# Altium project PCB_Project.PrjPcb
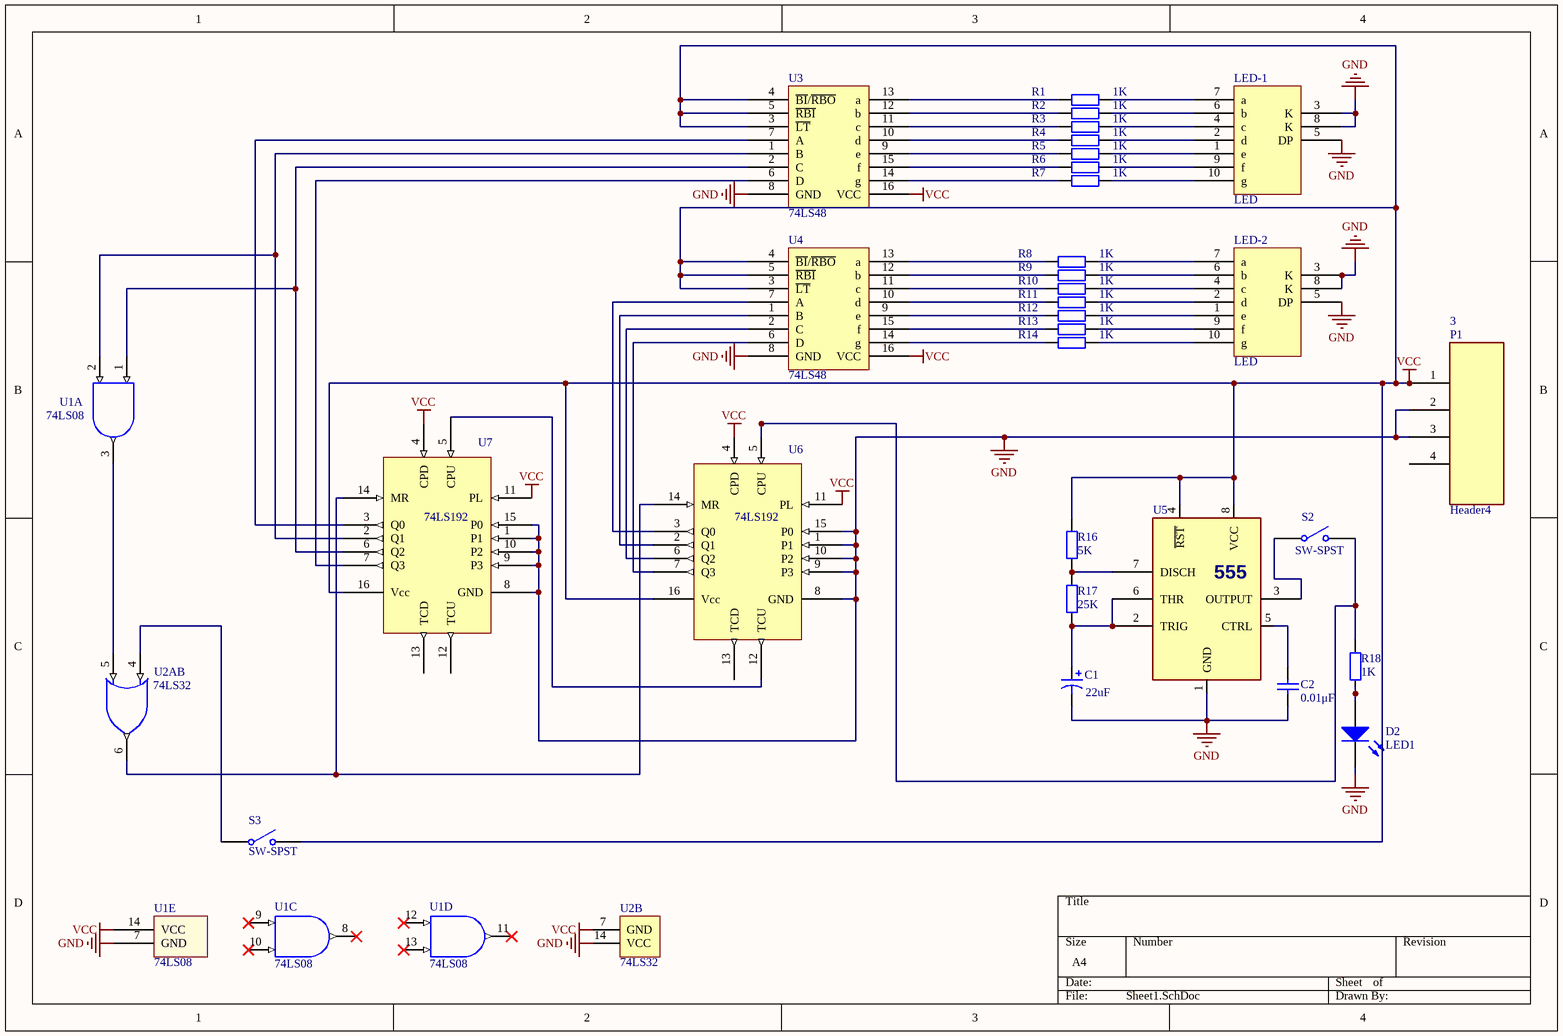
[diagram p0: Sheet1.SchDoc]
1 sheet, 33 parts. Net scope: global (net labels, ports and power ports of the same name join across sheets).
Board file: PCB1.PcbDoc

## Sheet Sheet1.SchDoc
size A4; SheetNumber: 1; SheetTotal: 1

### Parts
3  (no value)  [SIP4]
C1  value 22uF  [RB.2/.4]  (hidden comment: Cap Pol1)
C2  value 0.01μF  [RAD0.2]
D2  LED1  [RAD0.1]
LED-1  LED  [DPY_10-SEG_DP(LED)]
LED-2  LED  [DPY_10-SEG_DP(LED)]
R1  value 1K  [AXIAL-0.4]
R2  value 1K  [AXIAL-0.4]
R3  value 1K  [AXIAL-0.4]
R4  value 1K  [AXIAL-0.4]
R5  value 1K  [AXIAL-0.4]
R6  value 1K  [AXIAL-0.4]
R7  value 1K  [AXIAL-0.4]
R8  value 1K  [AXIAL-0.4]
R9  value 1K  [AXIAL-0.4]
R10  value 1K  [AXIAL-0.4]
R11  value 1K  [AXIAL-0.4]
R12  value 1K  [AXIAL-0.4]
R13  value 1K  [AXIAL-0.4]
R14  value 1K  [AXIAL-0.4]
R16  value 5K  [AXIAL-0.4]
R17  value 25K  [AXIAL-0.4]
R18  value 1K  [AXIAL-0.4]
S2  SW-SPST  [SIP3]
S3  SW-SPST  [SIP3]
U1  74LS08  [DIP-14]  (parts A,C,D,E of 5)
U2A  74LS32  [DIP-14]  (part B of 4)
U2B  74LS32  [DIP-14]
U3  74LS48  [DIP-16]
U4  74LS48  [DIP-16]
U5  (no value)  [DIP-8]
U6  74LS192  [DIP-16]
U7  74LS192  [DIP-16]

### Nets
GND: 3.2 3.3 C1.2 C2.1 D2.2(K) LED-1.3(K) LED-1.5(DP) LED-1.8(K) LED-2.3(K) LED-2.5(DP) LED-2.8(K) U1.7(GND) U2A.7(GND) U2B.14(VCC) U3.8 U4.8 U5.1(GND) U6.1(P1) U6.8(GND) U6.9(P3) U6.10(P2) U6.15(P0) U7.1(P1) U7.8(GND) U7.9(P3) U7.10(P2) U7.15(P0)
VCC: 3.1 R16.2 S3.2(NO) U1.14(VCC) U2A.14(VCC) U2B.7(GND) U3.3(~{LT}) U3.4(~{BI}/~{RBO}) U3.5(~{RBI}) U3.16 U4.3(~{LT}) U4.4(~{BI}/~{RBO}) U4.5(~{RBI}) U4.16 U5.4(~{RST}) U5.8(VCC) U6.11(PL) U6.16(Vcc) U7.11(PL) U7.16(Vcc)
NetC1_1: C1.1 R17.1 U5.2(TRIG) U5.6(THR)
NetC2_2: C2.2 U5.5(CTRL)
NetD2_1: D2.1(A) R18.2
NetLED-1_1: LED-1.1(e) R5.1
NetLED-1_2: LED-1.2(d) R4.1
NetLED-1_4: LED-1.4(c) R3.1
NetLED-1_6: LED-1.6(b) R2.1
NetLED-1_7: LED-1.7(a) R1.1
NetLED-1_9: LED-1.9(f) R6.1
NetLED-1_10: LED-1.10(g) R7.1
NetLED-2_1: LED-2.1(e) R12.1
NetLED-2_2: LED-2.2(d) R11.1
NetLED-2_4: LED-2.4(c) R10.1
NetLED-2_6: LED-2.6(b) R9.1
NetLED-2_7: LED-2.7(a) R8.1
NetLED-2_9: LED-2.9(f) R13.1
NetLED-2_10: LED-2.10(g) R14.1
NetR1_2: R1.2 U3.13(a)
NetR2_2: R2.2 U3.12(b)
NetR3_2: R3.2 U3.11(c)
NetR4_2: R4.2 U3.10(d)
NetR5_2: R5.2 U3.9(e)
NetR6_2: R6.2 U3.15(f)
NetR7_2: R7.2 U3.14(g)
NetR8_2: R8.2 U4.13(a)
NetR9_2: R9.2 U4.12(b)
NetR10_2: R10.2 U4.11(c)
NetR11_2: R11.2 U4.10(d)
NetR12_2: R12.2 U4.9(e)
NetR13_2: R13.2 U4.15(f)
NetR14_2: R14.2 U4.14(g)
NetR16_1: R16.1 R17.2 U5.7(DISCH)
NetR18_1: R18.1 S2.2(NO) U6.5(CPU)
NetS2_1: S2.1(COMMON) U5.3(OUTPUT)
NetS3_1: S3.1(COMMON) U2A.4(A)
NetU1_1: U1.1(A) U3.2(C) U7.6(Q2)
NetU1_2: U1.2(B) U3.1(B) U7.2(Q1)
NetU1_3: U1.3(Y) U2A.5(B)
NetU2A_6: U2A.6(Y) U6.14(MR) U7.14(MR)
NetU3_6: U3.6(D) U7.7(Q3)
NetU3_7: U3.7(A) U7.3(Q0)
NetU4_1: U4.1(B) U6.2(Q1)
NetU4_2: U4.2(C) U6.6(Q2)
NetU4_6: U4.6(D) U6.7(Q3)
NetU4_7: U4.7(A) U6.3(Q0)
NetU6_12: U6.12(TCU) U7.5(CPU)

Not connected (* = marked no-connect by the designer): 3 4; U1 8(Y)* 9(A)* 10(B)* 11(Y)* 12(A)* 13(B)*; U6 4(CPD) 13(TCD); U7 4(CPD) 12(TCU) 13(TCD)

### Notes on the sheet
- Labels drawn without touching a wire or pin: VCC
- (in symbol NE555_DIP8) 555; P1; Header4

### Library data of the parts
3 U5 = NE555_DIP8: 555 Timer, General-Purpose Single Bipolar Timer; MANF_P#: NE555P, NE555PE4; MANF: Texas Instruments; PARAM2: 4.5~16V; PARAM: 200mA output, 0~70oC
C1 = Cap Pol1: Polarized Capacitor (Radial); Published: 8-Jun-2000; LatestRevisionDate: 17-Jul-2002; LatestRevisionNote: Re-released for DXP Platform.; PackageReference: RB7.6-15; Publisher: Altium Limited; PackageDescription: Polarized Capacitor (Radial); 2 Leads
C2 = Cap: Capacitor; Published: 8-Jun-2000; LatestRevisionDate: 17-Jul-2002; LatestRevisionNote: Re-released for DXP Platform.; PackageReference: RAD-0.3; Publisher: Altium Limited; PackageDescription: Radial Cap, Thru-Hole; 2 Leads; 0.3 in Pin Spacing
D2 = LED1: Typical RED GaAs LED; Published: 8-Jun-2000; LatestRevisionDate: 08-Jul-2005; LatestRevisionNote: Mech Layer 1 removed.; PackageReference: LED-1; Publisher: Altium Limited; PackageDescription: LED; 2 Leads
R1-R14 R16-R18 = Res2: Resistor; Published: 8-Jun-2000; LatestRevisionDate: 17-Jul-2002; LatestRevisionNote: Re-released for DXP Platform.; PackageReference: AXIAL-0.4; Publisher: Altium Limited; PackageDescription: Axial Device, Thru-Hole; 2 Leads; 0.4 in Pin Spacing
S2 S3 = SW-SPST: Single-Pole, Single-Throw Switch; Published: 24-Mar-1999; LatestRevisionDate: 17-Jul-2002; LatestRevisionNote: Re-released for DXP Platform.; PackageReference: SPST-2; Publisher: Altium Limited; PackageDescription: Switch; 2 Leads
U1 = 74LS08: Quad 2-Input Positive-AND Gate
U2A = SN74F32D: Quadruple 2-Input Positive-OR Gate; Published: 8-Jun-2000; LatestRevisionDate: 13-Apr-2006; LatestRevisionNote: IPC-7351 Footprint Added.; DatasheetVersion: May-1999; PackageVersion: Jan-1998; PackageReference: D014; Publisher: Altium Limited; PackageDescription: 14-Pin Small Outline Integrated Circuit 1.27 mm Pitch; Code_IPC: SOIC127P600-14; ComponentLink1Description: Manufacturer Link; ComponentLink1URL: http://www.ti.com/; ComponentLink2Description: Datasheet; ComponentLink2URL: http://www-s.ti.com/sc/ds/SN54F32.pdf
U2B = Header 2: LatestRevisionDate: 17-Jul-2002; LatestRevisionNote: Re-released for DXP Platform.; Publisher: Altium Limited